# Altium schematic sheet Redundant Batteries.SchDoc
size A4
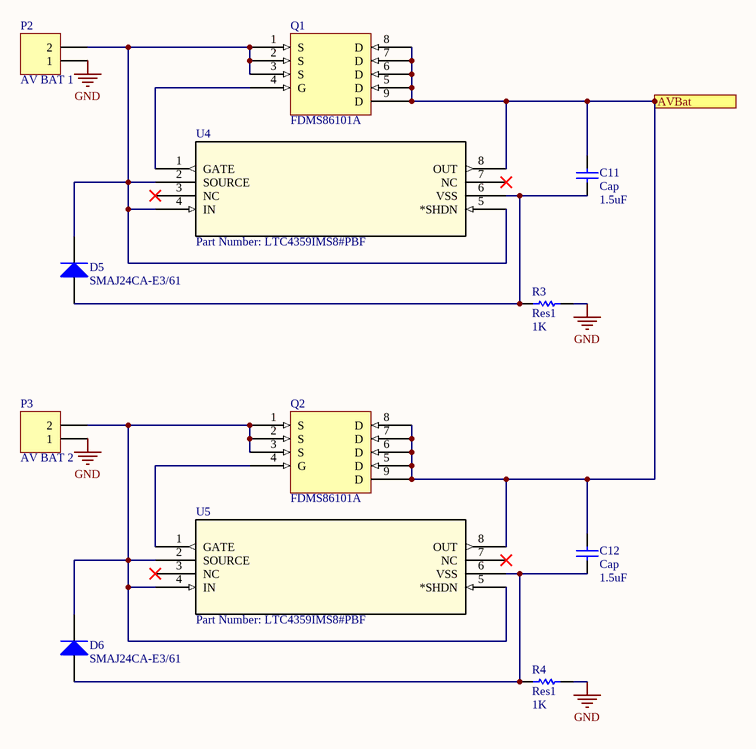
[diagram p0: Redundant Batteries.SchDoc]

## Parts
C11  Cap  value 1.5uF  [CAP_2012]
C12  Cap  value 1.5uF  [CAP_2012]
D5  SMAJ24CA-E3/61  [DIODE_DO-214AC]
D6  SMAJ24CA-E3/61  [DIODE_DO-214AC]
P2  AV BAT 1  [M80-5000000M5-02-333-00-000]
P3  AV BAT 2  [M80-5000000M5-02-333-00-000]
Q1  FDMS86101A  [FDMS86101A]
Q2  FDMS86101A  [FDMS86101A]
R3  Res1  value 1K  [STA_RMCF2512]
R4  Res1  value 1K  [STA_RMCF2512]
U4  Part Number: LTC4359IMS8#PBF  [MSOP-8_MS]
U5  Part Number: LTC4359IMS8#PBF  [MSOP-8_MS]

## Ports
AVBat (out)

## Nets
GND: P2.1 P3.1 R3.2 R4.2
AVBat: C11.2 C12.2 Q1.5(D) Q1.6(D) Q1.7(D) Q1.8(D) Q1.9(D) Q2.5(D) Q2.6(D) Q2.7(D) Q2.8(D) Q2.9(D) U4.8(OUT) U5.8(OUT) ; port AVBat
NetC11_1: C11.1 D5.1(A) R3.1 U4.6(VSS)
NetC12_1: C12.1 D6.1(A) R4.1 U5.6(VSS)
NetD5_2: D5.2(K) P2.2 Q1.1(S) Q1.2(S) Q1.3(S) U4.2(SOURCE) U4.4(IN) U4.5(*SHDN)
NetD6_2: D6.2(K) P3.2 Q2.1(S) Q2.2(S) Q2.3(S) U5.2(SOURCE) U5.4(IN) U5.5(*SHDN)
NetQ1_4: Q1.4(G) U4.1(GATE)
NetQ2_4: Q2.4(G) U5.1(GATE)

Not connected (* = marked no-connect by the designer): U4 3(NC)* 7(NC)*; U5 3(NC)* 7(NC)*

## Library data of the parts
C11 C12 = Cap: Capacitor; SPN: 445-7586-1-ND; Published: 8-Jun-2000; LatestRevisionDate: 17-Jul-2002; LatestRevisionNote: Re-released for DXP Platform.; PackageReference: RAD-0.3; Publisher: Altium Limited; PackageDescription: Radial Cap, Thru-Hole; 2 Leads; 0.3 in Pin Spacing
D5 D6 = Diode: Default Diode; SPN: SMAJ24CA-E3/61GICT-ND; Published: 8-Jun-2000; LatestRevisionDate: 17-Jul-2002; LatestRevisionNote: Re-released for DXP Platform.; PackageVersion: Sep-1996; PackageReference: SMC; Publisher: Altium Limited; PackageDescription: DO-214-AB/SMC; 2 C-Bend Leads; Body 7.9 x 5.9 mm, inc. leads (LxW); Code_JEDEC: DO-214-AB
P2 P3 = Header 2: Header, 2-Pin; LatestRevisionDate: 17-Jul-2002; LatestRevisionNote: Re-released for DXP Platform.; Publisher: Altium Limited
Q1 Q2 = FDMS86101A: MOSFET N-CH 100V 13A POWER56; SPN: FDMS86101ACT-ND
R3 R4 = Res1: Resistor; SPN: RMCF2512JT1K00CT-ND; Published: 8-Jun-2000; LatestRevisionDate: 17-Jul-2002; LatestRevisionNote: Re-released for DXP Platform.; PackageReference: AXIAL-0.3; Publisher: Altium Limited; PackageDescription: Axial Device, Thru-Hole; 2 Leads; 0.3 in Pin Spacing
U4 U5 = LTC4359IMS8#PBF: No Description Available; Vendor: Linear Technology; Built_By: EMA_UL_Team; Manufacturer_Part_Number: LTC4359IMS8#PBF; Copyright: Copyright (C) 2018 Accelerated Designs. All rights reserved; RefDes: RefDes; Type: DEV; Value: Value